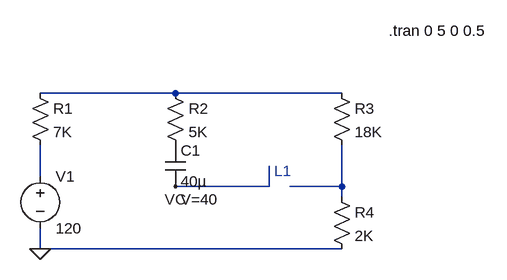
[diagram p0: schematic EJ1_teoría.asc]
EJ1_teoría.asc, the LTspice schematic file:
Version 4.1
SHEET 1 920 680
WIRE 320 96 112 96
WIRE 576 96 320 96
WIRE 112 224 112 176
WIRE 464 240 464 208
WIRE 464 240 320 240
WIRE 576 240 576 176
WIRE 576 240 496 240
WIRE 576 256 576 240
WIRE 112 336 112 304
WIRE 576 336 112 336
FLAG 112 336 0
FLAG 320 240 VC
SYMBOL res 96 80 R0
SYMATTR InstName R1
SYMATTR Value 7K
SYMBOL res 304 80 R0
SYMATTR InstName R2
SYMATTR Value 5K
SYMBOL res 560 80 R0
SYMATTR InstName R3
SYMATTR Value 18K
SYMBOL res 560 240 R0
SYMATTR InstName R4
SYMATTR Value 2K
SYMBOL voltage 112 208 R0
WINDOW 123 0 0 Left 0
WINDOW 39 0 0 Left 0
SYMATTR InstName V1
SYMATTR Value 120
SYMBOL cap 304 176 R0
WINDOW 39 24 84 Left 2
SYMATTR InstName C1
SYMATTR Value 40µ
SYMATTR SpiceLine V=40
TEXT 648 0 Left 2 !.tran 0 5 0 0.5
TEXT 472 216 Left 2 ;L1

The netlist it stands for:
* EJ1_teoría.asc
R1 N001 N002 7K
R2 N001 P001 5K
R3 N001 N003 18K
R4 N003 0 2K
V1 N002 0 120
C1 P001 VC 40µ V=40
.tran 0 5 0 0.5
* L1
.backanno
.end